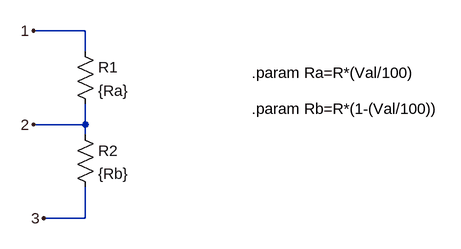
[diagram p0: schematic potentiometru.asc]
potentiometru.asc, the LTspice schematic file:
Version 4
SHEET 1 880 680
WIRE 176 48 96 48
WIRE 176 80 176 48
WIRE 176 192 176 160
WIRE 176 192 96 192
WIRE 176 208 176 192
WIRE 176 336 176 288
WIRE 176 336 112 336
FLAG 96 48 1
FLAG 96 192 2
FLAG 112 336 3
SYMBOL res 160 64 R0
SYMATTR InstName R1
SYMATTR Value {Ra}
SYMBOL res 160 192 R0
SYMATTR InstName R2
SYMATTR Value {Rb}
TEXT 432 112 Left 2 !.param Ra=R*(Val/100)
TEXT 432 168 Left 2 !.param Rb=R*(1-(Val/100))

The netlist it stands for:
* potentiometru.asc
R1 1 2 {Ra}
R2 2 3 {Rb}
.param Ra=R*(Val/100)
.param Rb=R*(1-(Val/100))
.backanno
.end